# Altium schematic sheet belt_output.SchDoc
size A3
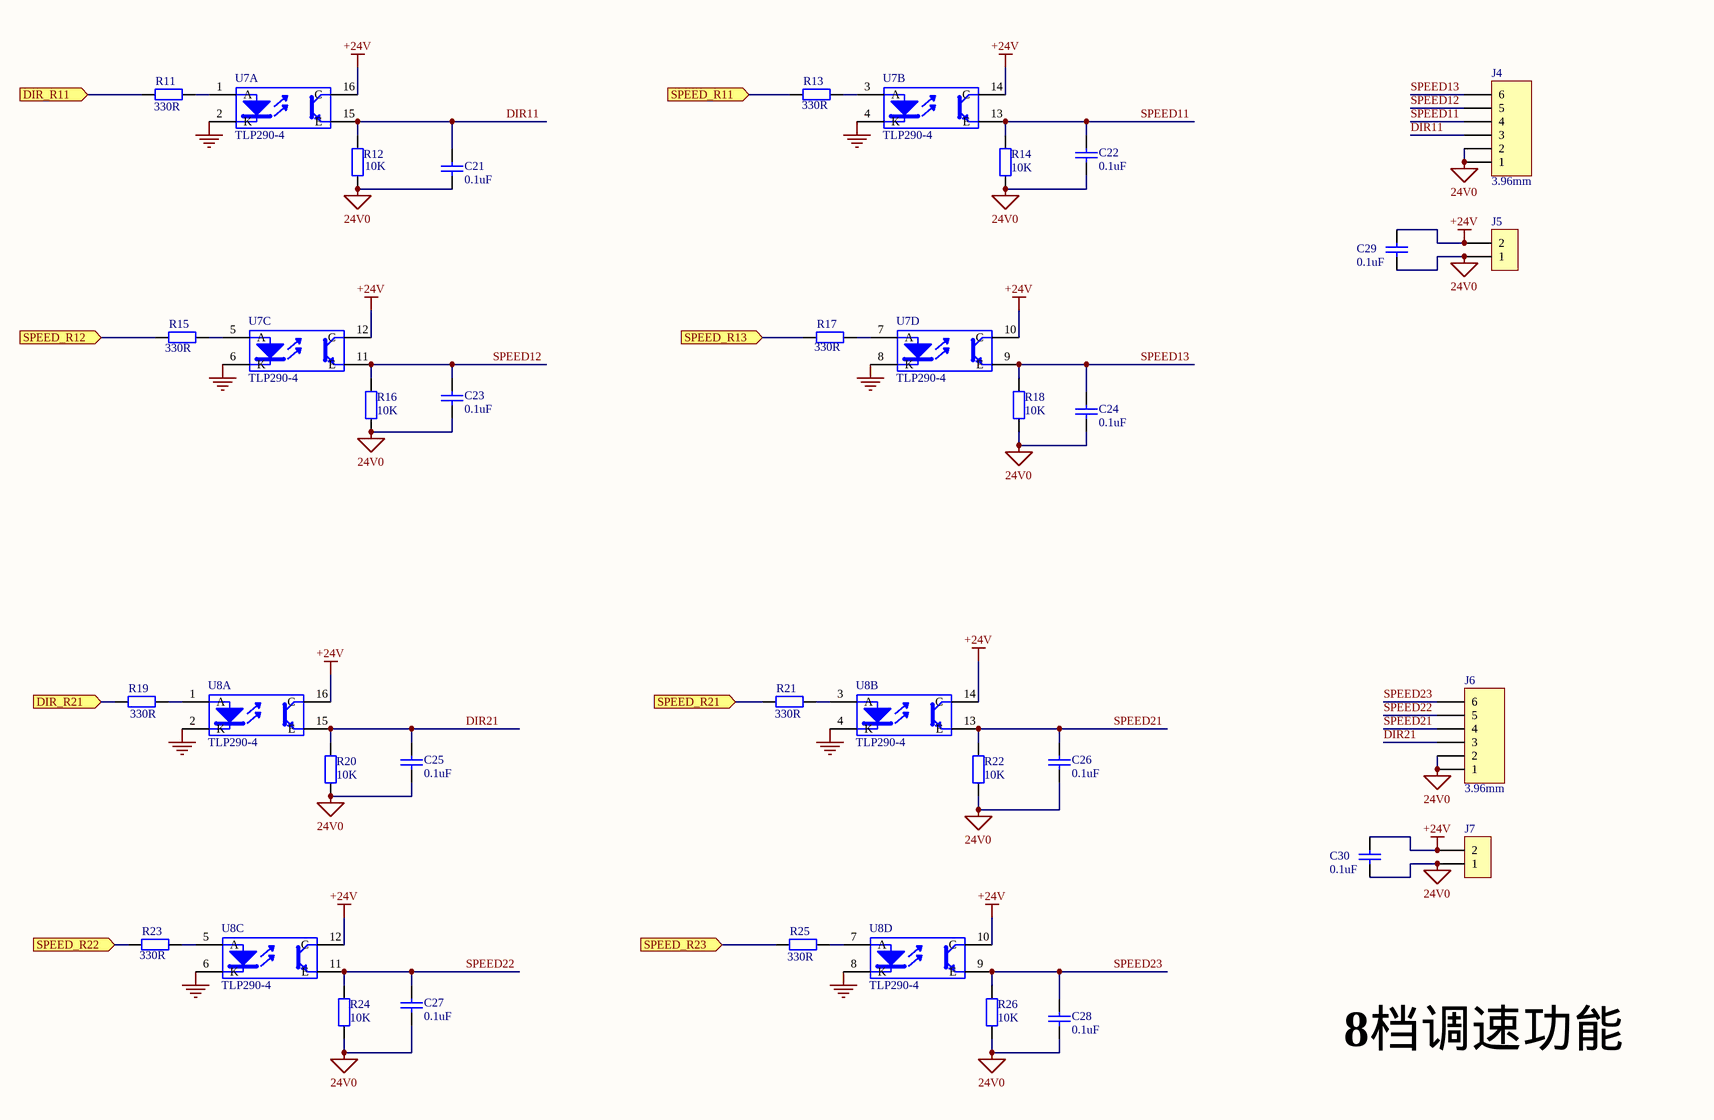
[diagram p0: belt_output.SchDoc]

## Parts
C21  0.1uF  [0805_CAP]
C22  0.1uF  [0805_CAP]
C23  0.1uF  [0805_CAP]
C24  0.1uF  [0805_CAP]
C25  0.1uF  [0805_CAP]
C26  0.1uF  [0805_CAP]
C27  0.1uF  [0805_CAP]
C28  0.1uF  [0805_CAP]
C29  0.1uF  [0805_CAP]
C30  0.1uF  [0805_CAP]
J4  3.96mm  [VH3.96_6P]
J5  HEADER1X2  [VH3.96_2P]  (value not drawn)
J6  3.96mm  [VH3.96_6P]
J7  HEADER1X2  [VH3.96_2P]  (value not drawn)
R11  330R  [0805_RES]
R12  10K  [0805_RES]
R13  330R  [0805_RES]
R14  10K  [0805_RES]
R15  330R  [0805_RES]
R16  10K  [0805_RES]
R17  330R  [0805_RES]
R18  10K  [0805_RES]
R19  330R  [0805_RES]
R20  10K  [0805_RES]
R21  330R  [0805_RES]
R22  10K  [0805_RES]
R23  330R  [0805_RES]
R24  10K  [0805_RES]
R25  330R  [0805_RES]
R26  10K  [0805_RES]
U7  TLP290-4  [SO16]  (parts A,B,C,D of 4)
U8  TLP290-4  [SO16]  (parts A,B,C,D of 4)

## Ports
DIR_R11 (in), DIR_R21 (in), SPEED_R11 (in), SPEED_R12 (in), SPEED_R13 (in), SPEED_R21 (in), SPEED_R22 (in), SPEED_R23 (in)

## Nets
24V0: C21.2 C22.2 C23.2 C24.2 C25.2 C26.2 C27.2 C28.2 C29.2 C30.2 J4.1 J4.2 J5.1 J6.1 J6.2 J7.1 R12.1 R14.1 R16.1 R18.1 R20.1 R22.1 R24.1 R26.1
+24V: C29.1 C30.1 J5.2 J7.2 U7.10(C) U7.12(C) U7.14(C) U7.16(C) U8.10(C) U8.12(C) U8.14(C) U8.16(C)
GND: U7.2(K) U7.4(K) U7.6(K) U7.8(K) U8.2(K) U8.4(K) U8.6(K) U8.8(K)
DIR11: C21.1 J4.3 R12.2 U7.15(E)
DIR21: C25.1 J6.3 R20.2 U8.15(E)
DIR_R11: R11.1 ; port DIR_R11
DIR_R21: R19.1 ; port DIR_R21
SPEED11: C22.1 J4.4 R14.2 U7.13(E)
SPEED12: C23.1 J4.5 R16.2 U7.11(E)
SPEED13: C24.1 J4.6 R18.2 U7.9(E)
SPEED21: C26.1 J6.4 R22.2 U8.13(E)
SPEED22: C27.1 J6.5 R24.2 U8.11(E)
SPEED23: C28.1 J6.6 R26.2 U8.9(E)
SPEED_R11: R13.1 ; port SPEED_R11
SPEED_R12: R15.1 ; port SPEED_R12
SPEED_R13: R17.1 ; port SPEED_R13
SPEED_R21: R21.1 ; port SPEED_R21
SPEED_R22: R23.1 ; port SPEED_R22
SPEED_R23: R25.1 ; port SPEED_R23
NetR11_2: R11.2 U7.1(A)
NetR13_2: R13.2 U7.3(A)
NetR15_2: R15.2 U7.5(A)
NetR17_2: R17.2 U7.7(A)
NetR19_2: R19.2 U8.1(A)
NetR21_2: R21.2 U8.3(A)
NetR23_2: R23.2 U8.5(A)
NetR25_2: R25.2 U8.7(A)

## Notes on the sheet
- 8档调速功能

## Library data of the parts
C21-C30 = Cap: Capacitor; Published: 8-Jun-2000; LatestRevisionDate: 17-Jul-2002; LatestRevisionNote: Re-released for DXP Platform.; PackageReference: RAD-0.3; Publisher: Altium Limited; Value: 0.1uF
J4 = Header 6H: Header, 6-Pin, Right Angle; LatestRevisionDate: 17-Jul-2002; LatestRevisionNote: Re-released for DXP Platform.; Publisher: Altium Limited
J6 = Header 6: Header, 6-Pin; LatestRevisionDate: 17-Jul-2002; LatestRevisionNote: Re-released for DXP Platform.; Publisher: Altium Limited
R11 R13 R15 R17 R19 R21 R23 R25 = Res2: Resistor; Value: 220; Published: 8-Jun-2000; LatestRevisionDate: 17-Jul-2002; LatestRevisionNote: Re-released for DXP Platform.; PackageReference: AXIAL-0.4; Publisher: Altium Limited
R12 R14 R16 R18 R20 R22 R24 R26 = Res2: Resistor; Published: 8-Jun-2000; LatestRevisionDate: 17-Jul-2002; LatestRevisionNote: Re-released for DXP Platform.; PackageReference: AXIAL-0.4; Publisher: Altium Limited; Value: 10K
U7 U8 = TLP521-4